# Altium schematic sheet I2C_ISOLATION.SchDoc: My title
size A3; Organization: University of California; Address1: 475 Portola Plaza; Address2: Los Angeles, CA 90095; Revision: R01; SheetNumber: 1; SheetTotal: 1
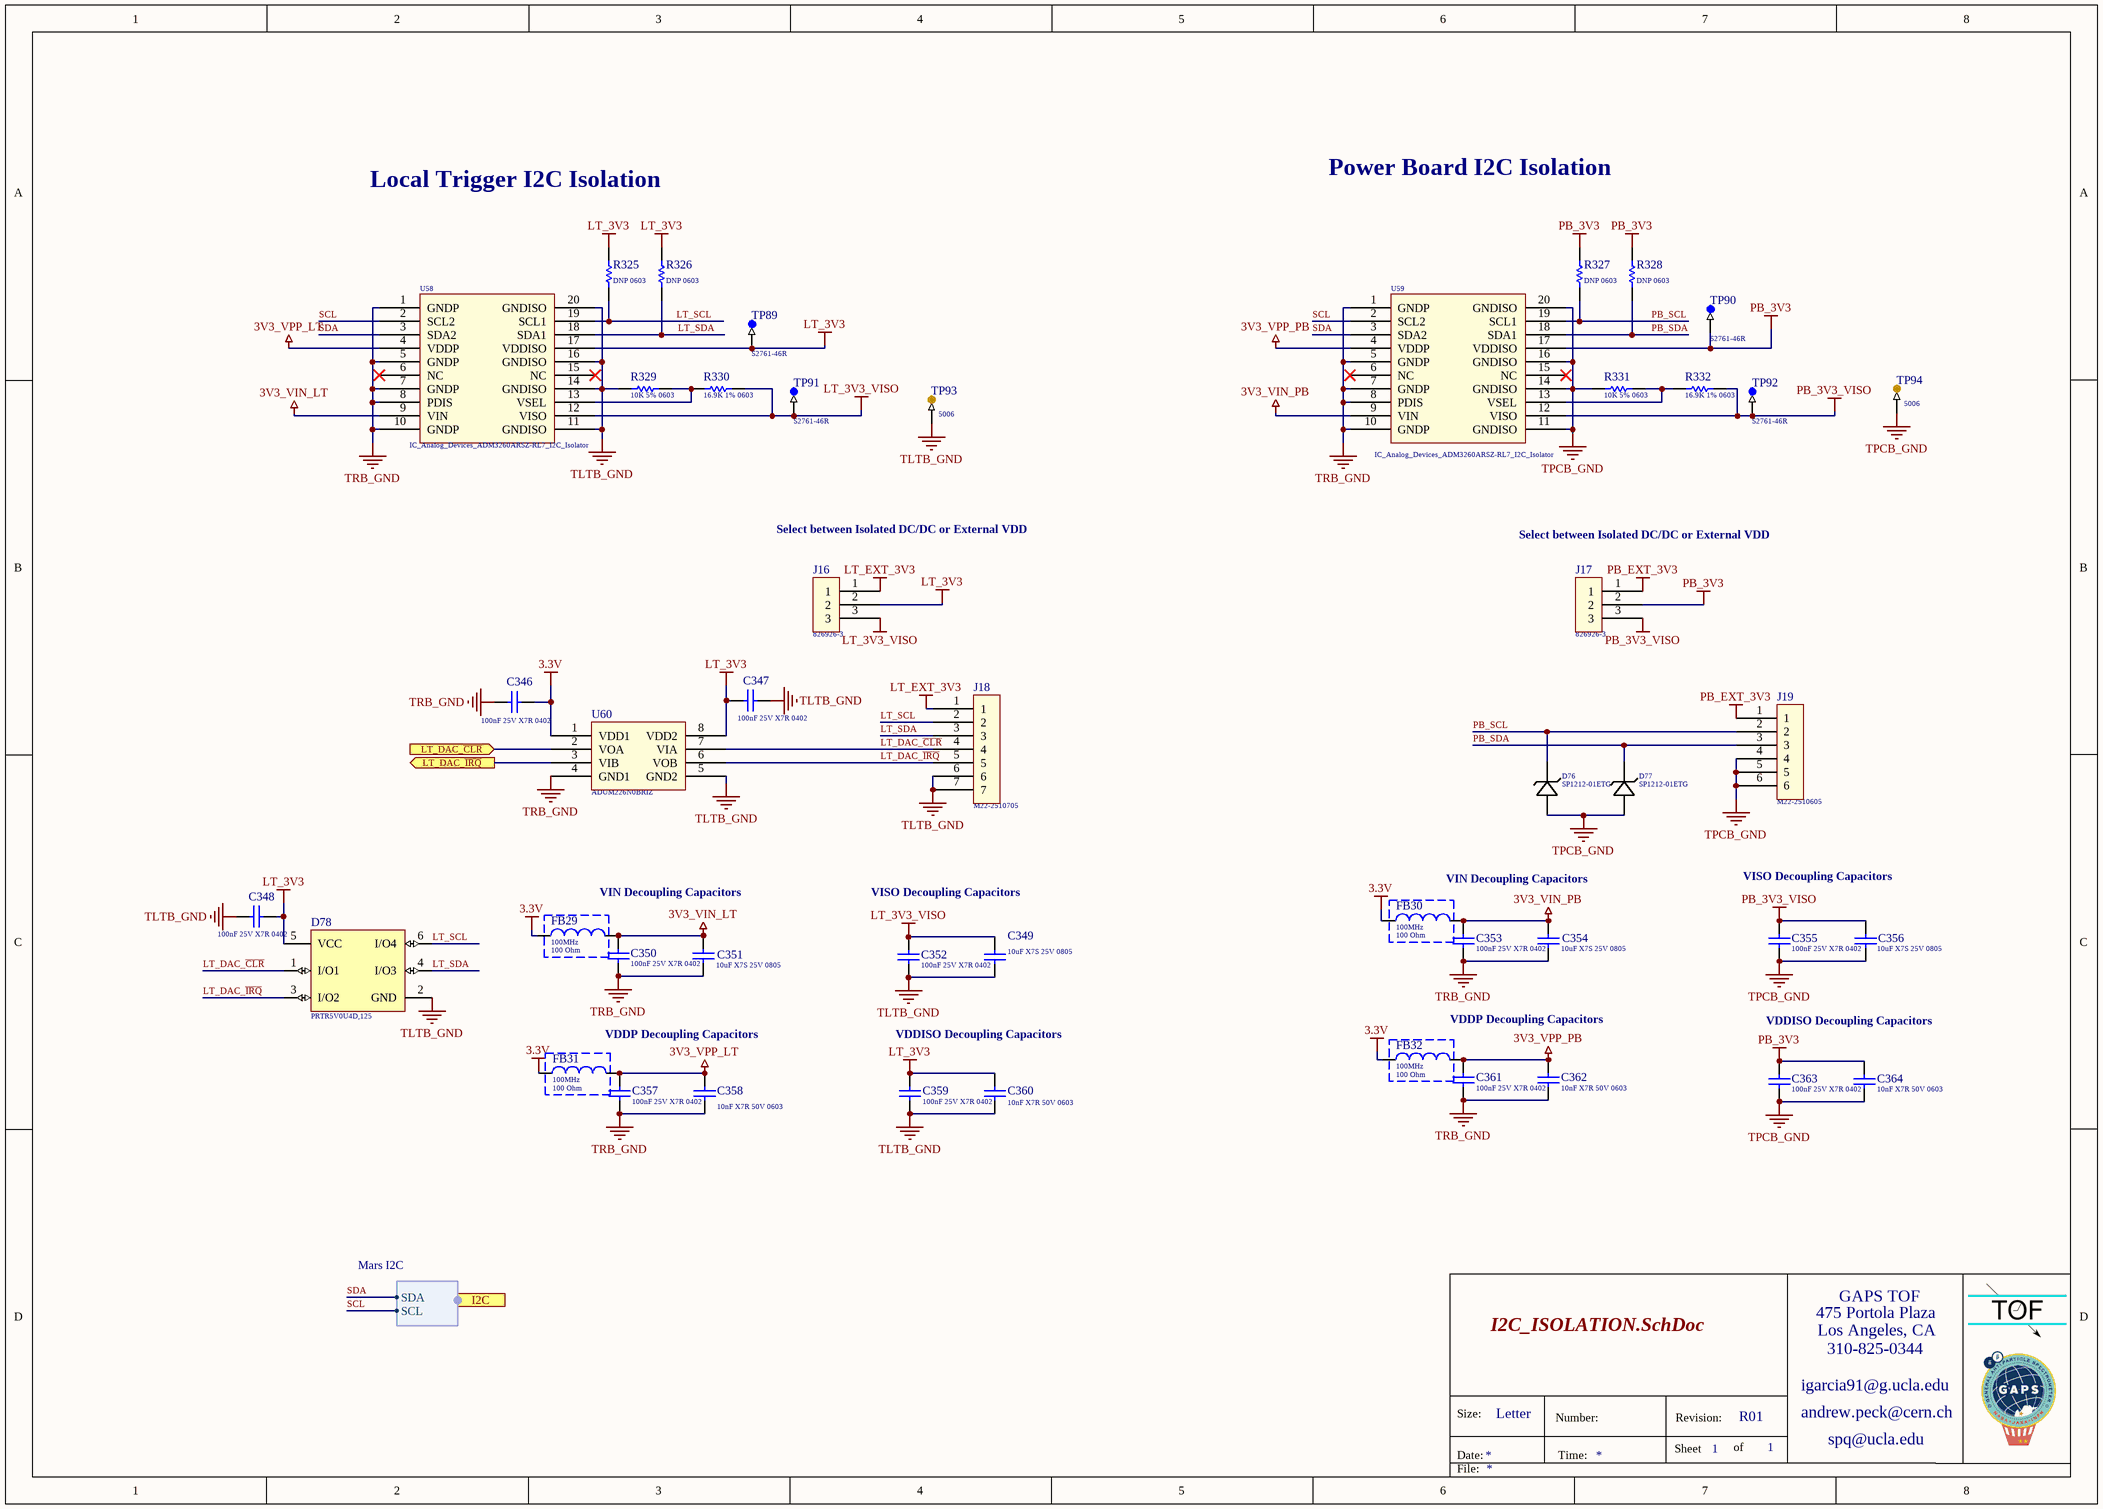
[diagram p0: I2C_ISOLATION.SchDoc]

## Parts
C346  Capacitance: 100nF 25V X7R 0402  [Cap_Taiyo_Yuden_TMK105B7104KV-FR_100nF]  (hidden comment: Cap_Taiyo_Yuden_TMK105B7104KV-FR_100nF)
C347  Capacitance: 100nF 25V X7R 0402  [Cap_Taiyo_Yuden_TMK105B7104KV-FR_100nF]  (hidden comment: Cap_Taiyo_Yuden_TMK105B7104KV-FR_100nF)
C348  Capacitance: 100nF 25V X7R 0402  [Cap_Taiyo_Yuden_TMK105B7104KV-FR_100nF]  (hidden comment: Cap_Taiyo_Yuden_TMK105B7104KV-FR_100nF)
C349  Capacitance: 10uF X7S 25V 0805  [Cap_Murata_ GRM21BC71E106ME11L_10uF]  (hidden comment: Cap_Murata_ GRM21BC71E106ME11L_10uF)
C350  Capacitance: 100nF 25V X7R 0402  [Cap_Taiyo_Yuden_TMK105B7104KV-FR_100nF]  (hidden comment: Cap_Taiyo_Yuden_TMK105B7104KV-FR_100nF)
C351  Capacitance: 10uF X7S 25V 0805  [Cap_Murata_ GRM21BC71E106ME11L_10uF]  (hidden comment: Cap_Murata_ GRM21BC71E106ME11L_10uF)
C352  Capacitance: 100nF 25V X7R 0402  [Cap_Taiyo_Yuden_TMK105B7104KV-FR_100nF]  (hidden comment: Cap_Taiyo_Yuden_TMK105B7104KV-FR_100nF)
C353  Capacitance: 100nF 25V X7R 0402  [Cap_Taiyo_Yuden_TMK105B7104KV-FR_100nF]  (hidden comment: Cap_Taiyo_Yuden_TMK105B7104KV-FR_100nF)
C354  Capacitance: 10uF X7S 25V 0805  [Cap_Murata_ GRM21BC71E106ME11L_10uF]  (hidden comment: Cap_Murata_ GRM21BC71E106ME11L_10uF)
C355  Capacitance: 100nF 25V X7R 0402  [Cap_Taiyo_Yuden_TMK105B7104KV-FR_100nF]  (hidden comment: Cap_Taiyo_Yuden_TMK105B7104KV-FR_100nF)
C356  Capacitance: 10uF X7S 25V 0805  [Cap_Murata_ GRM21BC71E106ME11L_10uF]  (hidden comment: Cap_Murata_ GRM21BC71E106ME11L_10uF)
C357  Capacitance: 100nF 25V X7R 0402  [Cap_Taiyo_Yuden_TMK105B7104KV-FR_100nF]  (hidden comment: Cap_Taiyo_Yuden_TMK105B7104KV-FR_100nF)
C358  Capacitance: 10nF X7R 50V 0603  [Kemet_C0603_0]  (hidden comment: Cap_Kemet_C0603C103J5RACTU_eec)
C359  Capacitance: 100nF 25V X7R 0402  [Cap_Taiyo_Yuden_TMK105B7104KV-FR_100nF]  (hidden comment: Cap_Taiyo_Yuden_TMK105B7104KV-FR_100nF)
C360  Capacitance: 10nF X7R 50V 0603  [Kemet_C0603_0]  (hidden comment: Cap_Kemet_C0603C103J5RACTU_eec)
C361  Capacitance: 100nF 25V X7R 0402  [Cap_Taiyo_Yuden_TMK105B7104KV-FR_100nF]  (hidden comment: Cap_Taiyo_Yuden_TMK105B7104KV-FR_100nF)
C362  Capacitance: 10nF X7R 50V 0603  [Kemet_C0603_0]  (hidden comment: Cap_Kemet_C0603C103J5RACTU_eec)
C363  Capacitance: 100nF 25V X7R 0402  [Cap_Taiyo_Yuden_TMK105B7104KV-FR_100nF]  (hidden comment: Cap_Taiyo_Yuden_TMK105B7104KV-FR_100nF)
C364  Capacitance: 10nF X7R 50V 0603  [Kemet_C0603_0]  (hidden comment: Cap_Kemet_C0603C103J5RACTU_eec)
D76  Series: SP1212-01ETG  [5V_ESD_Littlefuse_SP1212-01ETG_30kV]  (hidden comment: 5V_ESD_Littlefuse_SP1212-01ETG_30kV)
D77  Series: SP1212-01ETG  [5V_ESD_Littlefuse_SP1212-01ETG_30kV]  (hidden comment: 5V_ESD_Littlefuse_SP1212-01ETG_30kV)
D78  PRTR5V0U4D,125  [PRTR5V0U4D,125]
FB29  Measuring Frequency: 100MHz  Impedance: 100 Ohm  [FB_Wurth_Electronics_742792731_100Ohms]  (hidden comment: 742792731)
FB30  Measuring Frequency: 100MHz  Impedance: 100 Ohm  [FB_Wurth_Electronics_742792731_100Ohms]  (hidden comment: 742792731)
FB31  Measuring Frequency: 100MHz  Impedance: 100 Ohm  [FB_Wurth_Electronics_742792731_100Ohms]  (hidden comment: 742792731)
FB32  Measuring Frequency: 100MHz  Impedance: 100 Ohm  [FB_Wurth_Electronics_742792731_100Ohms]  (hidden comment: 742792731)
J16  Series: 826926-3  [Header_TE_Connectivity_826926-3_3POS_5A]  (hidden comment: Header_TE_Connectivity_826926-3_3POS_5A)
J17  Series: 826926-3  [Header_TE_Connectivity_826926-3_3POS_5A]  (hidden comment: Header_TE_Connectivity_826926-3_3POS_5A)
J18  Series: M22-2510705  [Header_Harwin_M22-2510705_7POS]  (hidden comment: Header_Harwin_M22-2510705_7POS)
J19  Series: M22-2510605  [Header_Harwin_ M22-2510605 _6POS]  (hidden comment: Header_Harwin_ M22-2510605 _6POS)
R325  Resistance: DNP 0603  [RES_DNP_0603]  (hidden comment: RES_DNP_0603)
R326  Resistance: DNP 0603  [RES_DNP_0603]  (hidden comment: RES_DNP_0603)
R327  Resistance: DNP 0603  [RES_DNP_0603]  (hidden comment: RES_DNP_0603)
R328  Resistance: DNP 0603  [RES_DNP_0603]  (hidden comment: RES_DNP_0603)
R329  10K 5% 0603  [RESC0603(1608)_L]
R330  Resistance: 16.9K 1% 0603  [Res_Panasonic_ERJ-3EKF1692V_16.9kOhm]  (hidden comment: Res_Panasonic_ERJ-3EKF1692V_16.9kOhm)
R331  10K 5% 0603  [RESC0603(1608)_L]
R332  Resistance: 16.9K 1% 0603  [Res_Panasonic_ERJ-3EKF1692V_16.9kOhm]  (hidden comment: Res_Panasonic_ERJ-3EKF1692V_16.9kOhm)
TP89  Series: S2761-46R  [TP_Harwin_S2761_46R]  (hidden comment: TP_Harwin_S2761_46R)
TP90  Series: S2761-46R  [TP_Harwin_S2761_46R]  (hidden comment: TP_Harwin_S2761_46R)
TP91  Series: S2761-46R  [TP_Harwin_S2761_46R]  (hidden comment: TP_Harwin_S2761_46R)
TP92  Series: S2761-46R  [TP_Harwin_S2761_46R]  (hidden comment: TP_Harwin_S2761_46R)
TP93  Series: 5006  [TP_Keystone_Electronics_5006]  (hidden comment: TP_Keystone_Electronics_5006)
TP94  Series: 5006  [TP_Keystone_Electronics_5006]  (hidden comment: TP_Keystone_Electronics_5006)
U58  IC_Analog_Devices_ADM3260ARSZ-RL7_I2C_Isolator  [IC_Analog_Devices_ADM3260ARSZ-RL7_I2C_Isolator]
U59  IC_Analog_Devices_ADM3260ARSZ-RL7_I2C_Isolator  [IC_Analog_Devices_ADM3260ARSZ-RL7_I2C_Isolator]
U60  Series: ADUM226N0BRIZ  [IC_Analog_Devices_ADUM226N0BRIZ_2CH_Isolator]  (hidden comment: IC_Analog_Devices_ADUM226N0BRIZ_2CH_Isolator)

## Ports
I2C (harness Mars I2C), LT_DAC_~{CLR} (in), LT_DAC_~{IRQ} (out)

## Harnesses
Mars I2C: SCL, SDA

## Nets
3.3V: C346.2 FB29.1 FB30.1 FB31.1 FB32.1 U60.1(VDD1)
3V3_VIN_LT: C350.2 C351.1 FB29.2 U58.9(VIN)
3V3_VIN_PB: C353.2 C354.1 FB30.2 U59.9(VIN)
3V3_VPP_LT: C357.2 C358.1 FB31.2 U58.4(VDDP)
3V3_VPP_PB: C361.2 C362.1 FB32.2 U59.4(VDDP)
LT_3V3: C347.2 C348.1 C359.2 C360.1 D78.5(VCC) J16.2 R325.1 R326.1 TP89.1 U58.17(VDDISO) U60.8(VDD2)
LT_3V3_VISO: C349.1 C352.2 J16.3 R330.1 TP91.1 U58.12(VISO)
LT_EXT_3V3: J16.1 J18.1
PB_3V3: C363.2 C364.1 J17.2 R327.1 R328.1 TP90.1 U59.17(VDDISO)
PB_3V3_VISO: C355.2 C356.1 J17.3 R332.1 TP92.1 U59.12(VISO)
PB_EXT_3V3: J17.1 J19.1
TLTB_GND: C347.1 C348.2 C349.2 C352.1 C359.1 C360.2 D78.2(GND) J18.6 J18.7 R329.1 TP93.1 U58.11(GNDISO) U58.14(GNDISO) U58.16(GNDISO) U58.20(GNDISO) U60.5(GND2)
TPCB_GND: C355.1 C356.2 C363.1 C364.2 D76.2 D77.2 J19.4 J19.5 J19.6 R331.1 TP94.1 U59.11(GNDISO) U59.14(GNDISO) U59.16(GNDISO) U59.20(GNDISO)
TRB_GND: C346.1 C350.1 C351.2 C353.1 C354.2 C357.1 C358.2 C361.1 C362.2 U58.1(GNDP) U58.5(GNDP) U58.7(GNDP) U58.8(PDIS) U58.10(GNDP) U59.1(GNDP) U59.5(GNDP) U59.7(GNDP) U59.8(PDIS) U59.10(GNDP) U60.4(GND1)
LT_DAC_~{CLR}: D78.1(I/O1) J18.4 U60.7(VIA)
LT_DAC_~{CLR}: U60.2(VOA) ; port LT_DAC_~{CLR}  [a separate net that carries the same name]
LT_DAC_~{IRQ}: D78.3(I/O2) J18.5 U60.6(VOB)
LT_DAC_~{IRQ}: U60.3(VIB) ; port LT_DAC_~{IRQ}  [a separate net that carries the same name]
LT_SCL: D78.6(I/O4) J18.2 R325.2 U58.19(SCL1)
LT_SDA: D78.4(I/O3) J18.3 R326.2 U58.18(SDA1)
PB_SCL: D76.1 J19.2 R327.2 U59.19(SCL1)
PB_SDA: D77.1 J19.3 R328.2 U59.18(SDA1)
SCL: U58.2(SCL2) U59.2(SCL2) ; port I2C.SCL
SDA: U58.3(SDA2) U59.3(SDA2) ; port I2C.SDA
NetR329_2: R329.2 R330.2 U58.13(VSEL)
NetR331_2: R331.2 R332.2 U59.13(VSEL)

Not connected (* = marked no-connect by the designer): U58 6(NC)* 15(NC)*; U59 6(NC)* 15(NC)*

## Notes on the sheet
- Power Board I2C Isolation
- Local Trigger I2C Isolation
- Select between Isolated DC/DC or External VDD
- (near J17) Select between Isolated DC/DC or External VDD
- VIN Decoupling Capacitors
- VISO Decoupling Capacitors
- VDDP Decoupling Capacitors
- VDDISO Decoupling Capacitors
- 475 Portola Plaza
- GAPS TOF
- igarcia91@g.ucla.edu
- Los Angeles, CA
- 310-825-0344
- Size:
- Date:
- Letter
- Number:
- Time:
- Sheet
- Revision:
- of
- andrew.peck@cern.ch
- spq@ucla.edu
- File:

## Library data of the parts
C346-C348 C350 C352 C353 C355 C357 C359 C361 C363 = Cap_Taiyo_Yuden_TMK105B7104KV-FR_100nF: CAP CER 100nF 25V X7R 0402; Supplier 1: Mouser; Supplier Part Number 1: 963-TMK105B7104KV-FR
C349 C351 C354 C356 = Cap_Murata_ GRM21BC71E106ME11L_10uF: CAP CER 10uF 25V X7R 0805; Supplier 1: Mouser; Supplier Part Number 1: 81-GRM21BC71E106ME1L
C358 C360 C362 C364 = Cap_Kemet_C0603C103J5RACTU_eec: CAP CER 10nF 50V X7R 0603; Manufacturer: Kemet; Mfg Package Ident: C0603; Part Number: C0603C103J5RACTU; helpURL: https://upverter.com/upn/revision/8a8d0c297e33ac74/; ComponentLink2Description: Datasheet; Temperature: -55°C to +125°C; Package: C0603; Supplier 2: Mouser; Price: 0.0184203126773; Supplier 1: Digi-Key; ComponentLink1URL: https://upverter.com/upn/revision/8a8d0c297e33ac74/; Supplier Part Number 2: 80-C0603C103J5R; Supplier Part Number 1: 399-1092-1-ND; Value: 10nF; ComponentLink1Description: Upverter; ComponentLink2URL: https://content.kemet.com/datasheets/KEM_C1002_X7R_SMD.pdf; RoHS: TRUE; Mouser Part Number: 80-C0603C103J5R; Temperature Range High: +125°C; Digikey Description: CAP CER 10000PF 50V X7R 0603; Digikey Part Number: 399-1092-1-ND; Lead Free: yes; Temperature Range Low: -55°C; Voltage: 50V
D76 D77 = 5V_ESD_Littlefuse_SP1212-01ETG_30kV: ESD Suppressors / TVS Diodes 5V 12A 30KV UNI-DIR; Supplier 1: Mouser; Supplier Part Number 1: 576-SP1212-01ETG
D78 = PRTR5V0U4D,125: ESD Suppressors / TVS Diodes 5.5V QUAD R-R ESD ULTRA LOW CAP; Supplier 1: Mouser; Supplier Part Number 1: 771-PRTR5V0U4D-T/R
FB29-FB32 = FB_Wurth_Electronics_742792731_100Ohms: FB SMD 100 OHM 25% 1.2A 0402; DC Resistance: 90mOhm; Supplier 1: Mouser; Supplier Part Number 1: 710-742792731
J16 J17 = Header_TE_Connectivity_826926-3_3POS_5A: Headers & Wire Housings 1X03 POS VERT TIN 5A; Supplier Part Number 1: 571-826926-3; Supplier 1: Mouser
J18 = Header_Harwin_M22-2510705_7POS: Headers & Wire Housings 6 WAY SIL VERT PC TAIL P/HDR; Supplier 1: Mouser; Supplier Part Number 1: 855-M22-2510705
J19 = Header_Harwin_ M22-2510605 _6POS: Headers & Wire Housings 6 WAY SIL VERT PC TAIL P/HDR; Supplier 1: Mouser; Supplier Part Number 1: 855-M22-2510605
R325-R328 = RES_DNP_0603: 0603 Do not place resistor
R329 R331 = CMP-1012-00098-1: 10K 0.1W 5% 0603 (1608 Metric)  SMD; Case-EIA: 0603; Value: 10000.00 Ohm; Case-Metric: 1608; Technology: SMT; Tolerance: 5 %; Power: 0.1 W
R330 R332 = Res_Panasonic_ERJ-3EKF1692V_16.9kOhm: RES SMD 16.9k OHM 5% 1/4W 0603; Supplier 1: Mouser; Supplier Part Number 1: 667-ERJ-3EKF1692V
TP89-TP92 = TP_Harwin_S2761_46R: Circuit Board Hardware - PCB SMT Mini Test Terminal, Reel; Supplier 1: Newark; Supplier Part Number 1: 76Y5391
TP93 TP94 = TP_Keystone_Electronics_5006: Circuit Board Hardware - PCB TEST POINT BLK .063; Supplier 1: Mouser; Supplier Part Number 1: 534-5006
U58 U59 = IC_Analog_Devices_ADM3260ARSZ-RL7_I2C_Isolator: Digital Isolators Isolated I2C & Power; Supplier Part Number 1: 584-ADM3260ARSZ-RL7; Supplier 1: Mouser
U60 = IC_Analog_Devices_ADUM226N0BRIZ_2CH_Isolator: Digital Isolators IC Robust Dual ISO 2:1 channel; Supplier 1: Mouser; Supplier Part Number 1: 584-ADUM226N0BRIZ